# EAGLE design FEZ Panda (EAGLE 5.04)
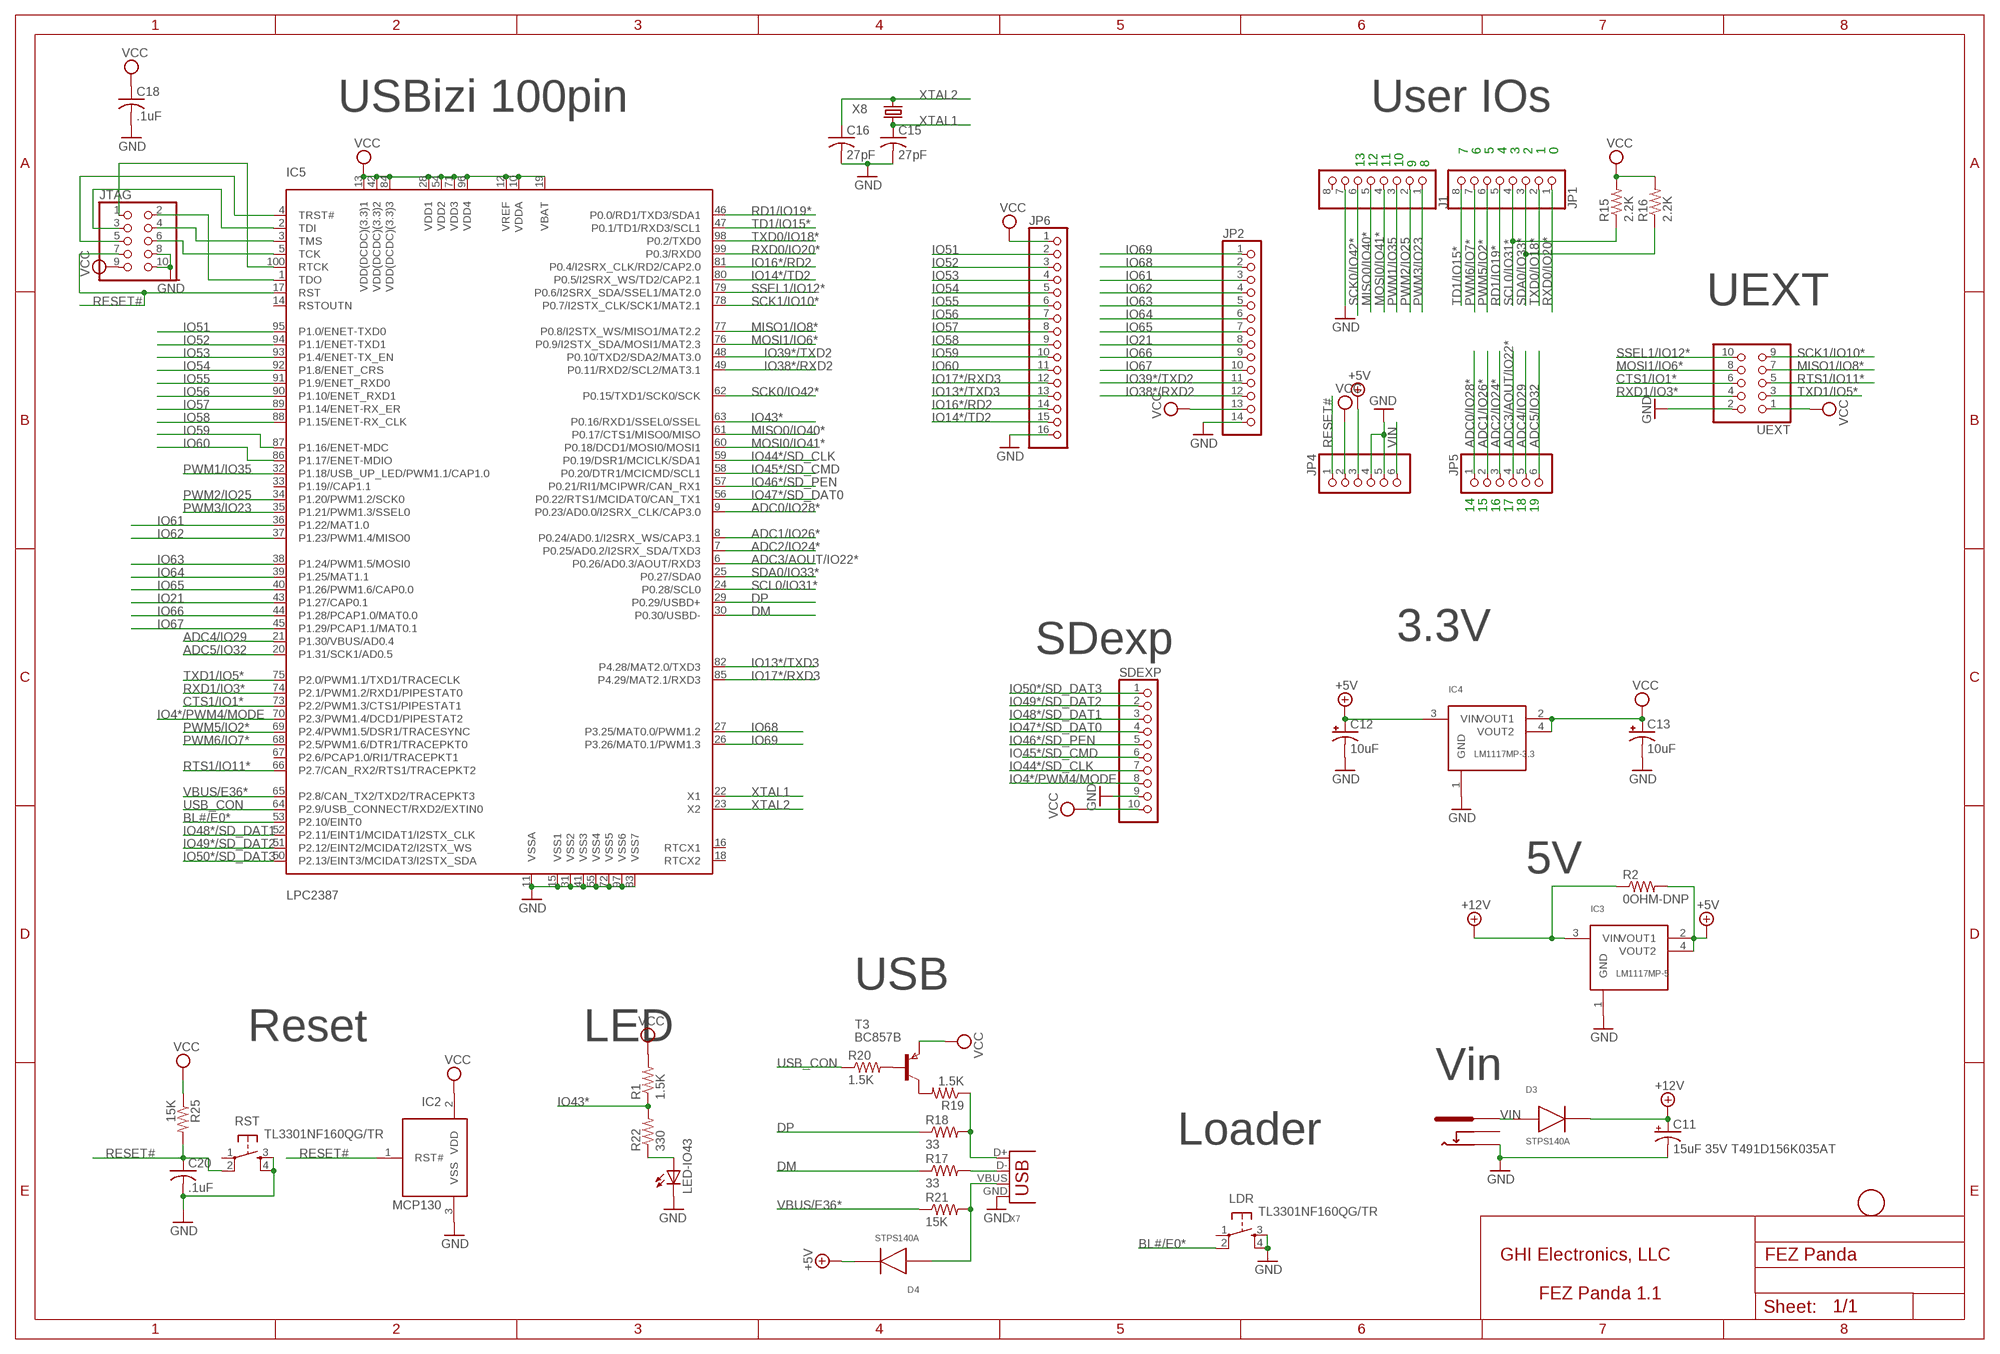
[diagram p0: schematic, sheet 1]

## Parts
C11  15uF 35V T491D156K035AT  CPOL-USD/7343-31W  [D/7343-31W]
C12  10uF  CPOL-USCT3528  [CT3528]
C13  10uF  CPOL-USCT3528  [CT3528]
C15  27pF  C-USC0603K  [C0603K]
C16  27pF  C-USC0603K  [C0603K]
C18  .1uF  C-USC0603K  [C0603K]
C20  .1uF  C-USC0603K  [C0603K]
D3  STPS140A  DIODE_SMA  [DIODE_SMA]
D4  STPS140A  DIODE_SMA  [DIODE_SMA]
IC2  MCP130  [SOT23]
IC3  LM1117MP-5  LM1117  [SOT223]
IC4  LM1117MP-3.3  LM1117  [SOT223]
IC5  LPC2387  LPC2368  [LQFP100]
J1  PINHD-1X8  [1X08]
JP1  PINHD-1X8  [1X08]
JP2  PINHD-1X14  [1X14]
JP4  PINHD-1X6  [1X06]
JP5  PINHD-1X6  [1X06]
JP6  PINHD-1X16  [1X16]
JTAG  PINHD-2X5  [2X05]
LDR  TL3301NF160QG/TR  DTSM-6  [DTSM-6]
LED-IO43  LEDCHIPLED_0805  [CHIPLED_0805]
R1  1.5K  R-US_R0603  [R0603]
R2  0OHM-DNP  R-US_R1206  [R1206]
R15  2.2K  R-US_R0603  [R0603]
R16  2.2K  R-US_R0603  [R0603]
R17  33  R-US_R0603  [R0603]
R18  33  R-US_R0603  [R0603]
R19  1.5K  R-US_R0603  [R0603]
R20  1.5K  R-US_R0603  [R0603]
R21  15K  R-US_R0603  [R0603]
R22  330  R-US_R0603  [R0603]
R25  15K  R-US_R0603  [R0603]
RST  TL3301NF160QG/TR  DTSM-6  [DTSM-6]
SDEXP  PINHD-1X10  [1X10]
T3  BC857B  PNPSOT23  [SOT-23]
U$1  FIDUCIALMOUNT  [FIDUCIA-MOUNT]
UEXT  PINHD-2X5  [2X05]
X6  PJ-102B_POWER_CON  [PJ-102B_POWER_CON]
X7  DX2R005HN2E700  USB-MB-S  [USB-MB-S]
X8  12Mhz  CRYTALSM49  [SM49]

## Nets
+5V: C12.+ D4.K IC3.2(VOUT1) IC3.4(VOUT2) IC4.3(VIN) JP4.3 R2.2
+12V: C11.+ D3.K IC3.3(VIN) R2.1
ADC0/IO28*: IC5.9(P0.23/AD0.0/I2SRX_CLK/CAP3.0) JP5.1
ADC1/IO26*: IC5.8(P0.24/AD0.1/I2SRX_WS/CAP3.1) JP5.2
ADC2/IO24*: IC5.7(P0.25/AD0.2/I2SRX_SDA/TXD3) JP5.3
ADC3/AOUT/IO22*: IC5.6(P0.26/AD0.3/AOUT/RXD3) JP5.4
ADC4/IO29: IC5.21(P1.30/VBUS/AD0.4) JP5.5
ADC5/IO32: IC5.20(P1.31/SCK1/AD0.5) JP5.6
BL#/E0*: IC5.53(P2.10/EINT0) LDR.2
CTS1/IO1*: IC5.73(P2.2/PWM1.3/CTS1/PIPESTAT1) UEXT.6
DM: IC5.30(P0.30/USBD-) R17.1
DP: IC5.29(P0.29/USBD+) R18.1
GND: C11.- C12.- C13.- C15.2 C16.2 C18.2 C20.2 IC2.3(VSS) IC3.1(GND) IC4.1(GND) IC5.11(VSSA) IC5.15(VSS1) IC5.31(VSS2) IC5.41(VSS3) IC5.55(VSS4) IC5.72(VSS5) IC5.83(VSS7) IC5.97(VSS6) J1.7 JP2.14 JP4.4 JP4.5 JP6.16 JTAG.8 JTAG.10 LDR.3 LDR.4 LED-IO43.C RST.3 RST.4 SDEXP.9 UEXT.2 X6.OUT X7.GND
IO4*/PWM4/MODE: IC5.70(P2.3/PWM1.4/DCD1/PIPESTAT2) SDEXP.8
IO13*/TXD3: IC5.82(P4.28/MAT2.0/TXD3) JP6.13
IO14*/TD2: IC5.80(P0.5/I2SRX_WS/TD2/CAP2.1) JP6.15
IO16*/RD2: IC5.81(P0.4/I2SRX_CLK/RD2/CAP2.0) JP6.14
IO17*/RXD3: IC5.85(P4.29/MAT2.1/RXD3) JP6.12
IO21: IC5.43(P1.27/CAP0.1) JP2.8
IO38*/RXD2: IC5.49(P0.11/RXD2/SCL2/MAT3.1) JP2.12
IO39*/TXD2: IC5.48(P0.10/TXD2/SDA2/MAT3.0) JP2.11
IO43*: IC5.63(P0.16/RXD1/SSEL0/SSEL) R1.1 R22.2
IO44*/SD_CLK: IC5.59(P0.19/DSR1/MCICLK/SDA1) SDEXP.7
IO45*/SD_CMD: IC5.58(P0.20/DTR1/MCICMD/SCL1) SDEXP.6
IO46*/SD_PEN: IC5.57(P0.21/RI1/MCIPWR/CAN_RX1) SDEXP.5
IO47*/SD_DAT0: IC5.56(P0.22/RTS1/MCIDAT0/CAN_TX1) SDEXP.4
IO48*/SD_DAT1: IC5.52(P2.11/EINT1/MCIDAT1/I2STX_CLK) SDEXP.3
IO49*/SD_DAT2: IC5.51(P2.12/EINT2/MCIDAT2/I2STX_WS) SDEXP.2
IO50*/SD_DAT3: IC5.50(P2.13/EINT3/MCIDAT3/I2STX_SDA) SDEXP.1
IO51: IC5.95(P1.0/ENET-TXD0) JP6.2
IO52: IC5.94(P1.1/ENET-TXD1) JP6.3
IO53: IC5.93(P1.4/ENET-TX_EN) JP6.4
IO54: IC5.92(P1.8/ENET_CRS) JP6.5
IO55: IC5.91(P1.9/ENET_RXD0) JP6.6
IO56: IC5.90(P1.10/ENET_RXD1) JP6.7
IO57: IC5.89(P1.14/ENET-RX_ER) JP6.8
IO58: IC5.88(P1.15/ENET-RX_CLK) JP6.9
IO59: IC5.87(P1.16/ENET-MDC) JP6.10
IO60: IC5.86(P1.17/ENET-MDIO) JP6.11
IO61: IC5.36(P1.22/MAT1.0) JP2.3
IO62: IC5.37(P1.23/PWM1.4/MISO0) JP2.4
IO63: IC5.38(P1.24/PWM1.5/MOSI0) JP2.5
IO64: IC5.39(P1.25/MAT1.1) JP2.6
IO65: IC5.40(P1.26/PWM1.6/CAP0.0) JP2.7
IO66: IC5.44(P1.28/PCAP1.0/MAT0.0) JP2.9
IO67: IC5.45(P1.29/PCAP1.1/MAT0.1) JP2.10
IO68: IC5.27(P3.25/MAT0.0/PWM1.2) JP2.2
IO69: IC5.26(P3.26/MAT0.1/PWM1.3) JP2.1
MISO0/IO40*: IC5.61(P0.17/CTS1/MISO0/MISO) J1.5
MISO1/IO8*: IC5.77(P0.8/I2STX_WS/MISO1/MAT2.2) UEXT.7
MOSI0/IO41*: IC5.60(P0.18/DCD1/MOSI0/MOSI1) J1.4
MOSI1/IO6*: IC5.76(P0.9/I2STX_SDA/MOSI1/MAT2.3) UEXT.8
N$1: IC5.2(TDI) JTAG.3
N$2: IC5.3(TMS) JTAG.4
N$3: IC5.5(TCK) JTAG.6
N$4: IC5.100(RTCK) JTAG.1
N$5: IC5.1(TDO) JTAG.2
N$6: R18.2 R19.1 X7.D+
N$7: R17.2 X7.D-
N$8: R20.2 T3.3(B)
N$9: IC5.4(TRST#) JTAG.5
N$10: R19.2 T3.1(C)
N$11: D4.A R21.2 X7.VBUS
N$12: LED-IO43.A R22.1
PWM1/IO35: IC5.32(P1.18/USB_UP_LED/PWM1.1/CAP1.0) J1.3
PWM2/IO25: IC5.34(P1.20/PWM1.2/SCK0) J1.2
PWM3/IO23: IC5.35(P1.21/PWM1.3/SSEL0) J1.1
PWM5/IO2*: IC5.69(P2.4/PWM1.5/DSR1/TRACESYNC) JP1.6
PWM6/IO7*: IC5.68(P2.5/PWM1.6/DTR1/TRACEPKT0) JP1.7
RD1/IO19*: IC5.46(P0.0/RD1/TXD3/SDA1) JP1.5
RESET#: C20.1 IC2.1(RST#) IC5.17(RST) JP4.1 JTAG.7 R25.2 RST.2
RTS1/IO11*: IC5.66(P2.7/CAN_RX2/RTS1/TRACEPKT2) UEXT.5
RXD0/IO20*: IC5.99(P0.3/RXD0) JP1.1
RXD1/IO3*: IC5.74(P2.1/PWM1.2/RXD1/PIPESTAT0) UEXT.4
SCK0/IO42*: IC5.62(P0.15/TXD1/SCK0/SCK) J1.6
SCK1/IO10*: IC5.78(P0.7/I2STX_CLK/SCK1/MAT2.1) UEXT.9
SCL0/IO31*: IC5.24(P0.28/SCL0) JP1.4 R15.1
SDA0/IO33*: IC5.25(P0.27/SDA0) JP1.3 R16.1
SSEL1/IO12*: IC5.79(P0.6/I2SRX_SDA/SSEL1/MAT2.0) UEXT.10
TD1/IO15*: IC5.47(P0.1/TD1/RXD3/SCL1) JP1.8
TXD0/IO18*: IC5.98(P0.2/TXD0) JP1.2
TXD1/IO5*: IC5.75(P2.0/PWM1.1/TXD1/TRACECLK) UEXT.3
USB_CON: IC5.64(P2.9/USB_CONNECT/RXD2/EXTIN0) R20.1
VBUS/E36*: IC5.65(P2.8/CAN_TX2/TXD2/TRACEPKT3) R21.1
VCC: C13.+ C18.1 IC2.2(VDD) IC4.2(VOUT1) IC4.4(VOUT2) IC5.10(VDDA) IC5.12(VREF) IC5.13(VDD(DCDC)(3.3)1) IC5.19(VBAT) IC5.28(VDD1) IC5.42(VDD(DCDC)(3.3)2) IC5.54(VDD2) IC5.71(VDD3) IC5.84(VDD(DCDC)(3.3)3) IC5.96(VDD4) JP2.13 JP4.2 JP6.1 JTAG.9 R1.2 R15.2 R16.2 R25.1 SDEXP.10 T3.2(E) UEXT.1
VIN: D3.A JP4.6 X6.IN
XTAL1: C15.1 IC5.22(X1) X8.1
XTAL2: C16.1 IC5.23(X2) X8.2
Unconnected: IC5.14(RSTOUTN) IC5.16(RTCX1) IC5.18(RTCX2) IC5.33(P1.19//CAP1.1) IC5.67(P2.6/PCAP1.0/RI1/TRACEPKT1) J1.8 LDR.1 RST.1 X6.OUT_CON

## Notes on the sheet
- USBizi 100pin | User IOs
- 7 | 6 | 5 | 4 | 3 | 2 | 1 | 0
- 13 | 12 | 11 | 10 | 9 | 8
- UEXT
- 14 | 15 | 16 | 17 | 18 | 19
- SDexp | 3.3V
- 5V
- USB
- Reset | LED
- Vin
- Loader
- GHI Electronics, LLC
- FEZ Panda 1.1

## Library data of the parts
C11-C13 = rcl:CPOL-US: POLARIZED CAPACITOR, American symbol
C15 C16 C18 C20 = rcl:C-US: CAPACITOR, American symbol
D3 D4 = GHI:DIODE_SMA
IC2 = GHI:MCP130
IC3 IC4 = GHI:LM1117
IC5 = GHI:LPC2368
J1 JP1 = pinhead:PINHD-1X8: PIN HEADER
JP2 = pinhead:PINHD-1X14: PIN HEADER
JP4 JP5 = pinhead:PINHD-1X6: PIN HEADER
JP6 = pinhead:PINHD-1X16: PIN HEADER
JTAG UEXT = pinhead:PINHD-2X5: PIN HEADER
LDR RST = switch-tact:DTSM-6
LED-IO43 = led:LED: LED OSRAM: - CHIPLED LG R971, LG N971, LY N971, LG Q971, LY Q971, LO R971, LY R971 LH N974, LH R974 LS Q976, LO Q976, LY Q976 LO Q996 - Hyper CHIPLED LW Q18S LB Q993, LB Q99A, LB R99A - SideLED LS A670, LO A670, LY A670, LG A670, LP A670 LB A673, LV A673, LT A673, LW A673 LH A674 LY A675 LS A676, LA A676, LO A676, LY A676, LW A676 LS A679, LY A679, LG A679 - Hyper Micro SIDELED® LS Y876, LA Y876, LO Y876, LY Y876 LT Y87S - SmartLED LW L88C, LW L88S LB L89C, LB L89S, LG L890 LS L89K, LO L89K, LY L89K LS L896, LA L896, LO L896, LY L896 - TOPLED LS T670, LO T670, LY T670, LG T670, LP T670 LSG T670, LSP T670, LSY T670, LOP T670, LYG T670 LG T671, LOG T671, LSG T671 LB T673, LV T673, LT T673, LW T673 LH T674 LS T676, LA T676, LO T676, LY T676, LB T676, LH T676, LSB T676, LW T676 LB T67C, LV T67C, LT T67C, LS T67K, LO T67K, LY T67K, LW E67C LS E67B, LA E67B, LO E67B, LY E67B, LB E67C, LV E67C, LT E67C LW T67C LS T679, LY T679, LG T679 LS T770, LO T770, LY T770, LG T770, LP T770 LB T773, LV T773, LT T773, LW T773 LH T774 LS E675, LA E675, LY E675, LS T675 LS T776, LA T776, LO T776, LY T776, LB T776 LHGB T686 LT T68C, LB T68C - Hyper Mini TOPLED® LB M676 - Mini TOPLED Santana® LG M470 LS M47K, LO M47K, LY M47K Source: http://www.osram.convergy.de LUXEON: - LUMILED® LXK2-PW12-R00, LXK2-PW12-S00, LXK2-PW14-U00, LXK2-PW14-V00 LXK2-PM12-R00, LXK2-PM12-S00, LXK2-PM14-U00 LXK2-PE12-Q00, LXK2-PE12-R00, LXK2-PE12-S00, LXK2-PE14-T00, LXK2-PE14-U00 LXK2-PB12-K00, LXK2-PB12-L00, LXK2-PB12-M00, LXK2-PB14-N00, LXK2-PB14-P00, LXK2-PB14-Q00 LXK2-PR12-L00, LXK2-PR12-M00, LXK2-PR14-Q00, LXK2-PR14-R00 LXK2-PD12-Q00, LXK2-PD12-R00, LXK2-PD12-S00 LXK2-PH12-R00, LXK2-PH12-S00 LXK2-PL12-P00, LXK2-PL12-Q00, LXK2-PL12-R00 Source: www.luxeon.com KINGBRIGHT: KA-3528ASYC Source: www.kingbright.com
R1 R2 R15-R22 R25 = rcl:R-US_: RESISTOR, American symbol
SDEXP = pinhead:PINHD-1X10: PIN HEADER
T3 = zetex:PNPSOT23: PNP TRANSISTOR
U$1 = SmartPrj:FIDUCIALMOUNT
X6 = GHI:PJ-102B_POWER_CON
X7 = con-usb-3:USB: USB Connectors
X8 = crystal:CRYTAL: CRYSTAL

## Net classes
0 default: width 0.254 mm, drill 0.381 mm, clearance 0.203 mm
2 gnd: width 0.254 mm, drill 0.381 mm, clearance 0.203 mm
3 usbvcc: width 0.508 mm, drill 0.508 mm, clearance 2.235 mm

## Board
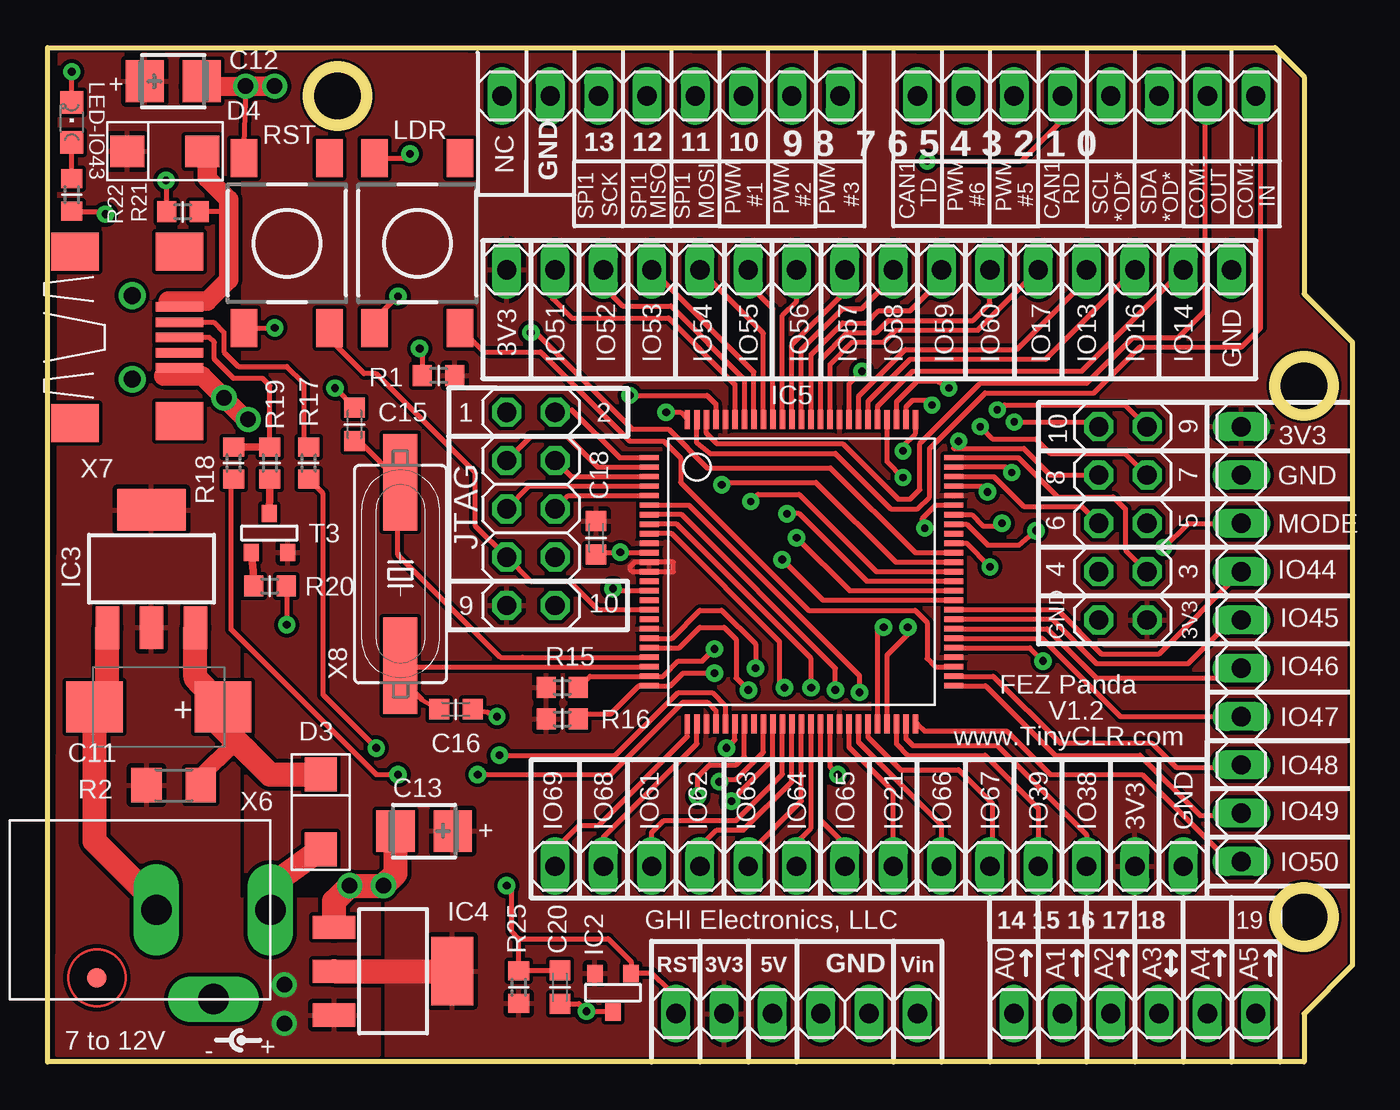
[diagram p1: board, top side]
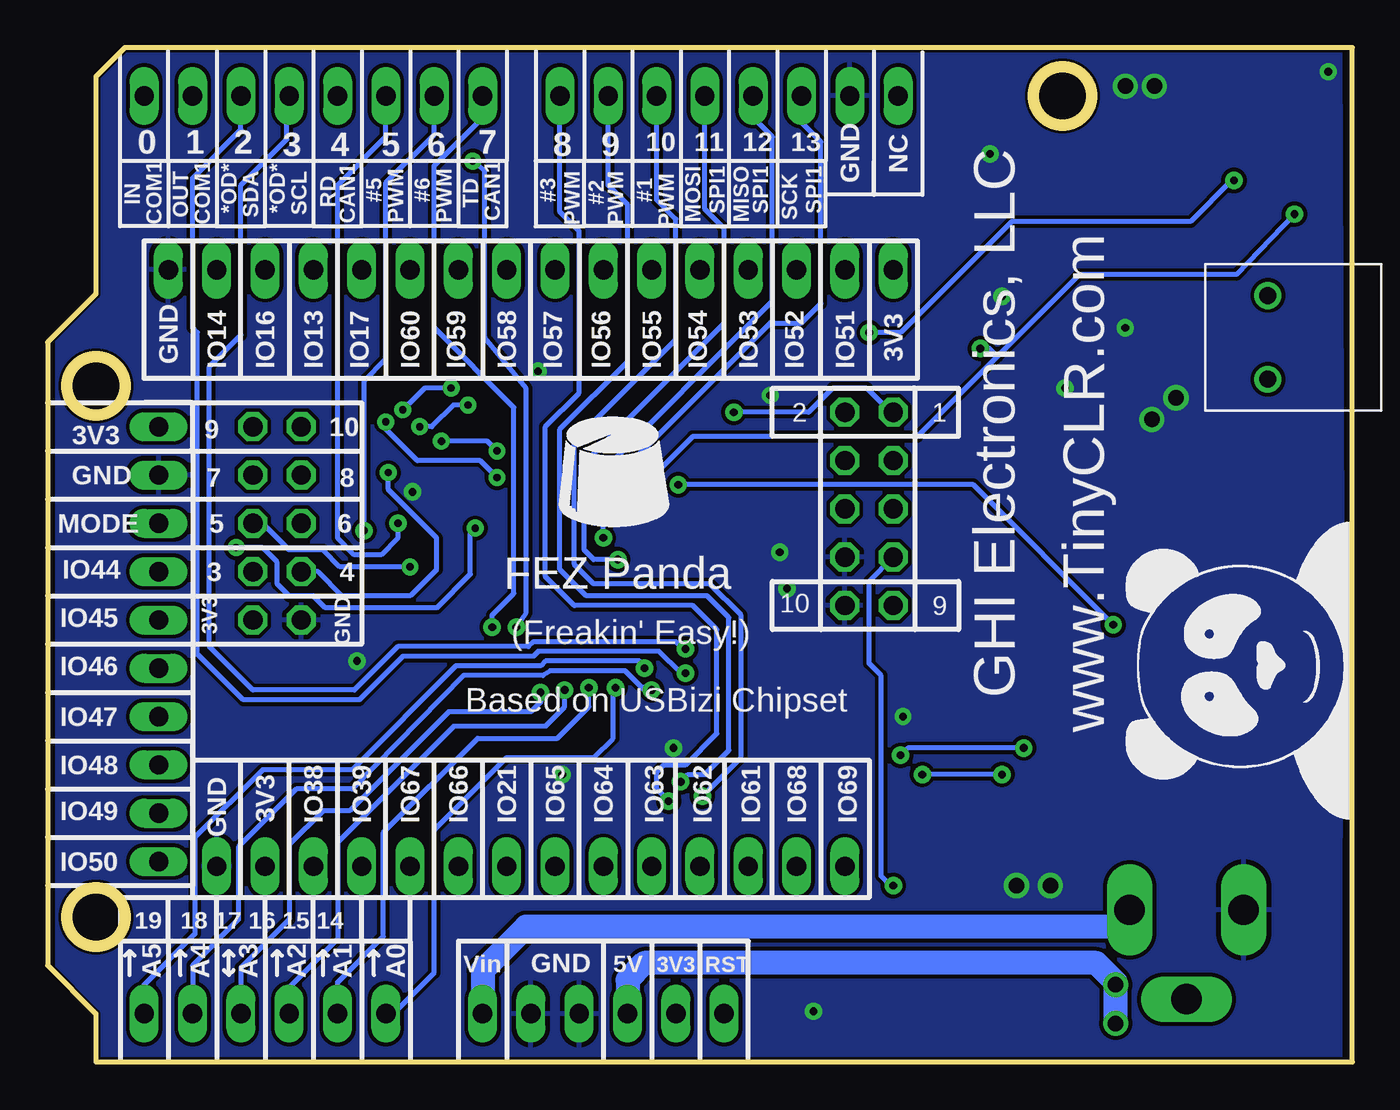
[diagram p2: board, bottom side, seen from below]

Size 68.58 x 53.34 mm. Coordinates in mm from the lower left corner, seen from the top.
Outline: 0,53.34 64.52,53.34 66.04,51.82 66.04,40.39 68.58,37.85 68.58,5.08 66.04,2.54 66.04,0 0,0 0,53.34
Outline: circle at 15.24,50.8 radius 1.52
Outline: circle at 66.04,7.62 radius 1.52
Outline: circle at 66.04,35.56 radius 1.52
Copper layers (1+16): Top 0.035mm / dielectric 1.5mm / Bottom 0.035mm
Design rules "default *": minimum track width 6mil, minimum drill 12mil, track to track 6mil, track to pad 6mil, pad to pad 6mil, via to via 6mil, smd to smd 6mil, copper to edge 5mil, drill to drill 6mil, minimum pad ring 10mil, minimum via ring 10mil, stop-mask expansion 16mil, vias tented up to drill 25mil, thermal gap 10mil
Holes 3.2 mm at 66.04,35.56 66.04,7.62 15.24,50.8

### Footprints (pad centres in the part's own frame; a part is rotated, then mirrored left to right if it is on the bottom)
D/7343-31W = smd 2.95 x 2.7: + 3.375,0; - -3.375,0
CT3528 = smd 2 x 2.2: + 1.5,0; - -1.5,0
C0603K = smd 1.05 x 1.08: 1 -0.875,0; 2 0.875,0
DIODE_SMA = smd 1.778 x 1.676: A -1.905,0; K 2.032,0
SOT23 = smd 0.813 x 0.914: 1 -0.95,-0.973; 2 0.95,-0.973; 3 0,1.049
SOT223 = smd 1.219 x 2.235: 1 -2.311,-3.099; 2 0,-3.099; 3 2.311,-3.099 | smd 3.6 x 2.2: 4 0,3.099
LQFP100 = smd 0.28 x 1: 1 -6,-8; 2 -5.5,-8; 3 -5,-8; 4 -4.5,-8; 5 -4,-8; 6 -3.5,-8; 7 -3,-8; 8 -2.5,-8; 9 -2,-8; 10 -1.5,-8; 11 -1,-8; 12 -0.5,-8; 13 0,-8; 14 0.5,-8; 15 1,-8; 16 1.5,-8; 17 2,-8; 18 2.5,-8; 19 3,-8; 20 3.5,-8; 21 4,-8; 22 4.5,-8; 23 5,-8; 24 5.5,-8; 25 6,-8; 51 6,8; 52 5.5,8; 53 5,8; 54 4.5,8; 55 4,8; 56 3.5,8; 57 3,8; 58 2.5,8; 59 2,8; 60 1.5,8; 61 1,8; 62 0.5,8; 63 0,8; 64 -0.5,8; 65 -1,8; 66 -1.5,8; 67 -2,8; 68 -2.5,8; 69 -3,8; 70 -3.5,8; 71 -4,8; 72 -4.5,8; 73 -5,8; 74 -5.5,8; 75 -6,8 | smd 1 x 0.28: 26 8,-6; 27 8,-5.5; 28 8,-5; 29 8,-4.5; 30 8,-4; 31 8,-3.5; 32 8,-3; 33 8,-2.5; 34 8,-2; 35 8,-1.5; 36 8,-1; 37 8,-0.5; 38 8,0; 39 8,0.5; 40 8,1; 41 8,1.5; 42 8,2; 43 8,2.5; 44 8,3; 45 8,3.5; 46 8,4; 47 8,4.5; 48 8,5; 49 8,5.5; 50 8,6; 76 -8,6; 77 -8,5.5; 78 -8,5; 79 -8,4.5; 80 -8,4; 81 -8,3.5; 82 -8,3; 83 -8,2.5; 84 -8,2; 85 -8,1.5; 86 -8,1; 87 -8,0.5; 88 -8,0; 89 -8,-0.5; 90 -8,-1; 91 -8,-1.5; 92 -8,-2; 93 -8,-2.5; 94 -8,-3; 95 -8,-3.5; 96 -8,-4; 97 -8,-4.5; 98 -8,-5; 99 -8,-5.5; 100 -8,-6
1X08 = drill 1.016 long: 1 -8.89,0; 2 -6.35,0; 3 -3.81,0; 4 -1.27,0; 5 1.27,0; 6 3.81,0; 7 6.35,0; 8 8.89,0
1X14 = drill 1.016 long: 1 -16.51,0; 2 -13.97,0; 3 -11.43,0; 4 -8.89,0; 5 -6.35,0; 6 -3.81,0; 7 -1.27,0; 8 1.27,0; 9 3.81,0; 10 6.35,0; 11 8.89,0; 12 11.43,0; 13 13.97,0; 14 16.51,0
1X06 = drill 1.016 long: 1 -6.35,0; 2 -3.81,0; 3 -1.27,0; 4 1.27,0; 5 3.81,0; 6 6.35,0
1X16 = drill 1.016 long: 1 -19.05,0; 2 -16.51,0; 3 -13.97,0; 4 -11.43,0; 5 -8.89,0; 6 -6.35,0; 7 -3.81,0; 8 -1.27,0; 9 1.27,0; 10 3.81,0; 11 6.35,0; 12 8.89,0; 13 11.43,0; 14 13.97,0; 15 16.51,0; 16 19.05,0
2X05 = drill 1.016 octagon: 1 -5.08,-1.27; 2 -5.08,1.27; 3 -2.54,-1.27; 4 -2.54,1.27; 5 0,-1.27; 6 0,1.27; 7 2.54,-1.27; 8 2.54,1.27; 9 5.08,-1.27; 10 5.08,1.27
DTSM-6 = smd 2 x 1.4: 1 -4.475,2.25; 2 4.475,2.25; 3 -4.475,-2.25; 4 4.475,-2.25
CHIPLED_0805 = smd 1.2 x 1.2: A 0,-1.05; C 0,1.05
R0603 = smd 1 x 1.1: 1 -0.85,0; 2 0.85,0
R1206 = smd 1.6 x 1.803: 1 -1.422,0; 2 1.422,0
1X10 = drill 1.016 long: 1 -11.43,0; 2 -8.89,0; 3 -6.35,0; 4 -3.81,0; 5 -1.27,0; 6 1.27,0; 7 3.81,0; 8 6.35,0; 9 8.89,0; 10 11.43,0
SOT-23 = smd 0.787 x 0.889: 1 0.025,-1.016; 2 -0.94,1.016; 3 0.991,1.016
FIDUCIA-MOUNT = smd 1.016 x 1.016: P$1 0,0
PJ-102B_POWER_CON = drill 1.6 long: IN -6,0; OUT 0,0; OUT_CON -3,4.7
USB-MB-S = smd 2.5 x 0.5: D+ 2.5,0; D- 2.5,0.8; GND 2.5,-1.6; ID 2.5,-0.8; VBUS 2.5,1.6 | smd 2.5 x 2: P$1 -3,-4.5; P$2 -3,4.5; P$3 2.5,-4.4; P$4 2.5,4.5 | drill 0.9 round: P$5 0,2.2; P$6 0,-2.2
SM49 = smd 5.08 x 1.778: 1 -4.826,0; 2 4.826,0

### Placement (x,y rotation side)
C11  5.84,18.67 0 top
C12  6.6,51.56 180 top
C13  19.79,12.14 0 top
C15  16.13,33.53 90 top
C16  21.46,18.54 0 top
C18  28.83,27.56 270 top
C20  26.92,3.94 270 top
D3  14.35,13.08 90 top
D4  6.22,47.88 180 top
IC2  29.72,3.68 180 top
IC3  5.46,25.93 0 top
IC4  18.16,4.78 270 top
IC5  39.62,25.78 270 top
J1  32.77,50.8 180 top
JP1  54.61,50.8 180 top
JP2  43.18,10.29 0 top
JP4  39.37,2.54 0 top
JP5  57.15,2.54 0 top
JP6  43.18,41.66 0 top
JTAG  25.4,29.08 270 top
LDR  19.43,43.05 270 top
LED-IO43  1.27,49.4 0 top
R1  20.55,36.09 0 top
R2  6.63,14.55 180 top
R15  27.05,19.68 180 top
R16  27.05,18.03 180 top
R17  13.72,31.5 90 top
R18  9.78,31.5 90 top
R19  11.68,31.5 270 top
R20  11.68,25.02 180 top
R21  7.11,44.7 0 top
R22  1.27,45.59 270 top
R25  24.77,3.94 90 top
RST  12.57,43.05 270 top
SDEXP  62.74,21.97 90 top
T3  11.68,27.81 180 top
U$1  2.59,4.43 0 top
UEXT  56.52,28.32 90 top
X6  5.71,8 180 top
X7  4.45,38.1 0 top
X8  18.54,25.65 270 top

### Tracks (layer width: path | path; a pad name or v marks a point on that pad's centre or on a via)
+5V  (via drill 0.81)
  Bottom 1.27: JP4.3 38.1,4.32 37.21,5.21 13.46,5.21 12.45,4.19 v12.45,4.06 v12.45,2.03
  pour Top: 10.03,52.96 0.64,52.96 0.51,0.38 17.4,0.38 17.4,8.51 10.03,8.51
+12V
  Top 0.813: R2.1 7.92,14.88 9.91,16.87
  Top 1.27: IC3.3 7.77,20.21 C11.+ 9.12,17.65 9.88,16.89 9.91,16.87 10.54,16.26 11.68,15.11 D3.K
ADC0/IO28*  (via drill 0.41)
  Top 0.254: IC5.9 32.8,27.78 38.48,22.1 38.48,19.94 v38.73,19.68
  Bottom 0.254: JP5.1 50.42,2.54 48.26,4.7 48.26,12.19 44.45,16 39.88,16 38.86,17.02 38.86,19.68 v38.73,19.68
ADC1/IO26*  (via drill 0.41)
  Top 0.254: IC5.8 33.06,28.28 40.13,21.21 40.13,21.08 v40.13,19.68
  Bottom 0.254: 40.39,19.68 v40.13,19.68 40.13,18.67 41.78,17.02 45.97,17.02 50.93,12.06 50.93,6.6 53.34,4.19 JP5.2
ADC2/IO24*  (via drill 0.41)
  Top 0.254: IC5.7 33.32,28.78 41.4,20.7 v41.4,19.56
  Bottom 0.254: 41.4,19.68 v41.4,19.56 41.4,18.67 42.42,17.65 47.24,17.65 53.34,11.56 53.34,6.48 55.88,3.94 JP5.3
ADC3/AOUT/IO22*  (via drill 0.41)
  Top 0.254: IC5.6 33.71,29.28 42.67,20.32 v42.67,19.43
  Bottom 0.254: JP5.4 58.42,4.95 55.88,7.49 55.88,11.43 54.1,13.21 52.7,13.21 47.5,18.41 43.18,18.41 42.67,18.92 v42.67,19.43
ADC4/IO29  (via drill 0.41)
  Top 0.254: IC5.21 33.21,21.78 34.29,22.86 35.56,22.86 36.2,22.23 36.2,20.19 v36.83,19.56
  Bottom 0.254: JP5.5 60.96,5.08 58.55,7.49 58.55,11.3 55.5,14.35 52.58,14.35 46.74,20.32 42.55,20.32 42.16,20.57 38.23,20.57 37.21,19.56 37.34,19.68 36.96,19.68 v36.83,19.56
ADC5/IO32  (via drill 0.41)
  Top 0.254: IC5.20 32.82,22.28 34.29,23.75 35.43,23.75 37.21,21.97 v37.21,20.7 37.21,20.83
  Bottom 0.254: JP5.6 63.5,4.06 60.83,6.73 60.83,11.81 57.28,15.37 52.58,15.37 47.12,20.83 42.67,20.83 42.42,21.08 37.47,21.08 37.21,20.83 v37.21,20.7
BL#/E0*
  Top 0.254: IC5.53 46.66,20.78 46.23,21.21 46.23,23.11 45.59,23.75 40.01,23.75 33.27,30.48 33.27,31.75 32.38,32.64 30.61,32.64 25.91,37.34 22.92,37.34 LDR.2
CTS1/IO1*
  Top 0.254: IC5.73 49.74,30.78 51.31,29.21 54.36,29.21 UEXT.6
DM  (via drill 0.41)
  Top 0.254: IC5.30 35.62,18.73 34.92,19.43 33.15,19.43 29.84,16.13 v23.75,16.13 | v17.27,16.51 14.48,19.3 14.48,29.88 R17.1
  Bottom 0.254: v17.27,16.51 23.37,16.51 v23.75,16.13
DP  (via drill 0.41)
  Top 0.254: IC5.29 35.12,18.47 34.67,18.92 33.4,18.92 29.59,15.11 v22.61,15.11 | R18.1 9.65,30.52 9.65,22.73 17.27,15.11 v18.41,15.11
  Bottom 0.254: v18.41,15.11 v22.61,15.11
GND  (via drill 0.38, 0.41, 0.81)
  Top 0.254: IC5.72 49.09,30.28 v49.4,29.97 | IC5.83 42.12,35.65 v42.8,36.32 | 29.86,26.78 IC5.11 | 29.86,26.78 v30.1,26.8 | IC5.15 29.83,24.78 v29.72,24.89 | IC5.31 36.12,16.95 v35.69,16.51 | v41.53,15.11 41.12,15.52 IC5.41 | IC5.55 51.62,21.78 v52.32,21.08 | C20.2 27.93,3.06 v28.32,2.67 29.68,2.67 IC2.3 | IC5.97 35.12,34.6 34.67,35.05 v30.61,35.05 | C16.2 23.1,18.4 v23.62,18.16 | LED-IO43.C v1.27,52.07 | C15.2 16.13,34.42 v15.11,35.43 | RST.4 11.91,38.58 v11.94,38.61 | RST.3 10.45,51.27 v10.41,51.31 | LDR.3 18.83,47.53 v19.05,47.75 | LDR.4 17.18,39.02 v18.41,40.26 | 29.86,26.78 28.93,26.78 C18.2
  Top 0.305: X7.GND 6.53,36.5 6.1,36.07
  Top 1.016: C12.- 8.31,51.31 8.08,51.28 7.59,51.28 v10.41,51.31 v11.94,51.31 | 6.1,36.07 8.13,36.07 v9.27,34.92 10.41,33.78 v10.54,33.78
  Top 1.27: IC3.1 3.15,19.43 C11.- 2.47,11.61 5.46,8.64 5.46,8.26 X6.OUT | IC4.1 15.06,8.46 v15.88,9.27 v17.65,9.27 18.29,9.9 C13.-
  pour Bottom: 0.64,53.59 68.07,53.59 68.07,0 0.64,0 0.64,10.67 0.51,21.46
IO4*/PWM4/MODE  (via drill 0.38)
  Top 0.254: SDEXP.8 59.94,28.32 v58.67,27.05 | IC5.70 46.68,29.28 45.97,28.57 45.97,28.19 v46.1,28.07
  Bottom 0.254: v58.67,27.05 57.28,27.05 56.52,26.29 56.52,25.15 55.88,24.51 54.61,24.51 53.98,23.88 48.13,23.88 46.35,25.65 46.35,27.81 v46.1,28.07
IO13*/TXD3
  Top 0.254: IC5.82 42.62,35 45.09,37.47 50.93,37.47 54.61,41.15 JP6.13
IO14*/TD2
  Top 0.254: IC5.80 43.62,34.48 45.47,36.32 54.36,36.32 JP6.15
IO16*/RD2
  Top 0.254: IC5.81 43.12,34.74 45.34,36.96 52.45,36.96 JP6.14
IO17*/RXD3
  Top 0.254: JP6.12 48.9,38.48 44.58,38.48 43.94,37.85 42.29,37.85 41.12,36.68 IC5.85
IO21
  Top 0.254: IC5.43 42.12,16.55 44.45,14.22 JP2.8
IO38*/RXD2
  Top 0.254: IC5.49 45.12,16.98 45.47,16.64 49.91,16.64 54.61,11.94 JP2.12
IO39*/TXD2
  Top 0.254: IC5.48 44.62,16.72 45.21,16.13 49.28,16.13 52.07,13.34 JP2.11
IO43*  (via drill 0.38, 0.41)
  Top 0.254: IC5.63 43.56,25.78 39.5,29.84 37.34,29.84 v36.96,29.46 | v3.05,44.58 3.17,44.7 1.31,44.7 R22.2 | R1.1 19.7,37.38 v19.56,37.52
  Bottom 0.254: v36.96,29.46 36.96,30.61 34.67,32.89 22.86,32.89 18.66,37.1 | 18.66,37.1 14.35,41.4 6.1,41.4 v3.05,44.58 | v19.56,37.52 19.07,37.52 18.66,37.1
IO44*/SD_CLK
  Top 0.254: IC5.59 53.05,23.78 55.37,21.46 58.42,21.46 SDEXP.7
IO45*/SD_CMD
  Top 0.254: IC5.58 52.79,23.28 55.12,20.95 59.94,20.95 62.1,23.11 62.7,23.28 SDEXP.6
IO46*/SD_PEN
  Top 0.254: IC5.57 52.53,22.78 55.12,20.19 61.72,20.19 62.23,20.7 SDEXP.5 63.37,20.7
IO47*/SD_DAT0
  Top 0.254: IC5.56 52.27,22.28 56.39,18.16 SDEXP.4
IO48*/SD_DAT1
  Top 0.254: SDEXP.3 62.61,15.49 59.31,15.49 58.04,16.76 53.21,16.76 49.7,20.28 IC5.52
IO49*/SD_DAT2
  Top 0.254: SDEXP.2 62.61,12.95 60.58,12.95 57.4,16.13 52.96,16.13 49.31,19.78 IC5.51
IO50*/SD_DAT3
  Top 0.254: IC5.50 45.72,17.78 46.1,17.4 50.42,17.4 52.7,15.11 57.53,15.11 62.1,10.54 SDEXP.1
IO51
  Top 0.254: IC5.95 36.12,35.63 32.64,39.12 27.56,39.12 26.54,40.13 26.54,41.53 JP6.2
IO52
  Top 0.254: IC5.94 36.62,35.89 32.77,39.75 30.23,39.75 29.34,40.64 29.34,41.53 JP6.3
IO53
  Top 0.254: IC5.93 37.12,36.28 JP6.4
IO54
  Top 0.254: IC5.92 37.62,38.32 JP6.5
IO55
  Top 0.254: IC5.91 38.12,39.6 36.96,40.77 36.96,41.53 JP6.6
IO56
  Top 0.254: IC5.90 38.62,39.26 39.37,40.01 JP6.7
IO57
  Top 0.254: IC5.89 39.12,37.73 41.78,40.39 JP6.8
IO58
  Top 0.254: IC5.88 39.62,37.47 41.78,39.62 42.8,39.62 44.45,41.27 JP6.9
IO59
  Top 0.254: IC5.87 40.12,37.2 41.78,38.86 43.05,38.86 43.69,39.5 45.34,39.5 46.48,40.64 46.48,41.27 46.61,41.27 JP6.10
IO60
  Top 0.254: IC5.86 40.62,36.94 42.04,38.35 43.56,38.35 44.2,38.99 48.64,38.99 49.53,39.88 JP6.11
IO61
  Top 0.254: IC5.36 38.62,15.13 36.2,12.7 32.38,12.7 31.75,12.06 JP2.3
IO62
  Top 0.254: IC5.37 39.12,14.74 36.58,12.19 35.18,12.19 34.16,11.18 34.16,10.41 JP2.4
IO63
  Top 0.254: IC5.38 39.62,13.72 36.83,10.92 JP2.5
IO64
  Top 0.254: IC5.39 40.12,12.31 39.12,11.3 39.12,10.54 JP2.6
IO65
  Top 0.254: IC5.40 40.62,12.72 41.91,11.43 JP2.7
IO66
  Top 0.254: IC5.44 42.62,16.81 46.99,12.45 JP2.9
IO67
  Top 0.254: IC5.45 43.12,17.07 44.83,15.37 47.88,15.37 49.66,13.59 49.66,10.41 JP2.10
IO68
  Top 0.254: IC5.27 34.12,16.73 29.21,11.81 JP2.2
IO69
  Top 0.254: IC5.26 33.62,17.11 28.96,12.45 27.94,12.45 26.67,11.18 JP2.1
MISO0/IO40*  (via drill 0.41)
  Top 0.254: IC5.61 42.15,24.78 v39.37,27.56
  Bottom 0.254: J1.5 31.5,49.66 30.48,48.64 30.48,40.01 39.88,30.61 39.88,28.7 39.37,28.19 v39.37,27.56
MISO1/IO8*  (via drill 0.38)
  Top 0.254: v49.02,33.4 49.66,32.77 51.94,32.77 52.7,32 56.64,32 UEXT.7 | IC5.77 45.12,34.46 45.47,34.8 46.23,34.8 v46.48,34.54
  Bottom 0.254: v46.48,34.54 47.24,34.54 48.39,33.4 v49.02,33.4
MOSI0/IO41*  (via drill 0.41)
  Top 0.254: IC5.60 40.74,24.28 v38.61,26.42
  Bottom 0.254: J1.4 34.04,44.83 33.02,43.81 33.02,38.86 40.39,31.5 40.39,26.92 39.88,26.42 v38.61,26.42
MOSI1/IO6*  (via drill 0.38)
  Top 0.254: UEXT.8 52.7,30.86 51.31,32.26 47.62,32.26 v47.88,32.64 | v44.96,32.13 44.96,32.38 45.62,33.05 IC5.76
  Bottom 0.254: v44.96,32.13 45.47,32.64 v47.88,32.64
N$1
  Top 0.254: IC5.2 28.92,31.28 27.3,32.89 25.4,32.89 JTAG.3
N$2
  Top 0.254: IC5.3 27.51,30.78 JTAG.4
N$3
  Top 0.254: IC5.5 27.37,29.78 JTAG.6
N$4  (via drill 0.41)
  Top 0.254: IC5.100 33.62,33.81 33.27,34.16 v32.51,34.16
  Bottom 0.254: v32.51,34.16 28.57,34.16 27.3,35.43 25.53,35.43 24.13,34.04 JTAG.1
N$5
  Top 0.254: IC5.1 30.07,31.78 27.56,34.29 26.92,34.29 26.8,34.16 JTAG.2
N$6
  Top 0.254: X7.D+ 8.51,38.1 8.76,37.85 8.76,36.96 9.78,35.94 11.3,35.94 11.68,35.56 R19.1
  Top 0.406: R18.2 R19.1
N$7
  Top 0.254: X7.D- 8.72,38.9 9.27,38.35 9.27,37.34 10.03,36.58 12.57,36.58 13.46,35.69 13.46,32.77 13.72,32.51 R17.2
N$8
  Top 0.406: T3.3 10.82,25.8 R20.2
N$9
  Top 0.254: IC5.4 25.33,30.28 JTAG.5
N$10
  Top 0.406: R19.2 11.68,29.95 T3.1
N$11
  Top 0.254: R21.2 9.27,44.7 9.53,44.96
  Top 0.406: X7.VBUS 6.66,39.7 6.35,40.01
  Top 1.016: 6.35,40.01 8.38,40.01 9.53,41.15 9.53,44.96 9.53,45.34 8.38,46.48 8.38,47.88 8.26,48.01 D4.A
N$12
  Top 0.254: R22.1 LED-IO43.A
PWM1/IO35  (via drill 0.41)
  Top 0.254: IC5.32 36.62,16.05 36.2,15.62 34.8,15.62 34.16,14.99 v34.16,13.97
  Bottom 0.254: J1.3 36.58,45.34 35.56,44.32 35.56,37.97 40.89,32.64 40.89,26.16 39.88,25.15 33.78,25.15 32.13,23.5 32.13,16 v34.16,13.97
PWM2/IO25  (via drill 0.41)
  Top 0.254: IC5.34 37.62,16.29 36.2,14.86 35.43,14.86 v35.31,14.73
  Bottom 0.254: J1.2 39.12,46.1 38.1,45.09 38.1,36.83 41.66,33.27 41.66,25.91 40.26,24.51 33.91,24.51 32.77,23.37 32.77,16.38 34.04,15.11 34.92,15.11 v35.31,14.73
PWM3/IO23  (via drill 0.41)
  Top 0.254: IC5.35 38.12,15.9 v35.94,13.72
  Bottom 0.254: J1.1 41.66,44.7 40.64,43.69 40.64,35.18 42.42,33.4 42.42,25.53 40.89,24 34.67,24 33.4,22.73 33.4,17.27 35.05,15.62 36.2,15.62 36.58,15.24 36.58,14.35 v35.94,13.72
PWM5/IO2*  (via drill 0.41)
  Top 0.254: IC5.69 48.56,28.78 49.15,28.19 50.04,28.19 v50.16,28.32
  Bottom 0.254: JP1.6 50.8,48.64 53.34,46.1 53.34,27.56 52.45,26.67 51.05,26.67 50.16,27.56 v50.16,28.32
PWM6/IO7*  (via drill 0.41)
  Top 0.254: IC5.68 48.3,28.28 49.4,27.18 51.05,27.18 v51.94,27.94 52.03,28.03
  Bottom 0.254: v51.94,27.94 51.94,35.81 50.8,36.96 50.8,46.23 48.26,48.77 JP1.7
RD1/IO19*  (via drill 0.38, 0.41)
  Top 0.254: IC5.46 43.62,22.67 v43.94,22.86 | v46.23,47.37 51.18,47.37 53.34,49.53 53.34,49.78 JP1.5
  Bottom 0.254: v43.94,22.86 43.43,23.62 43.43,35.43 45.59,38.1 45.59,46.86 v46.23,47.37
RESET#  (via drill 0.41)
  Top 0.254: JP4.1 32.66,2.54 32.66,3.79 31.75,4.7 30.71,4.7 IC2.1 30.67,5.27 29.46,6.48 24.77,6.48 | 24.77,6.48 24.38,6.86 24.38,9.02 v24.13,9.27 | C20.1 25.3,4.81 R25.2 24.77,6.48 | RST.2 14.86,38.49 14.86,37.97 16.64,36.2 17.27,36.2 22.48,30.99 22.48,28.19 JTAG.7 25.4,25.27 27.43,25.27 28.92,23.78 IC5.17
  Bottom 0.254: v24.13,9.27 24.26,9.27 24.77,9.78 24.77,20.32 25.4,20.95 25.4,25.27 JTAG.7
RTS1/IO11*  (via drill 0.38)
  Top 0.254: IC5.66 48.28,27.28 v49.53,26.04
  Bottom 0.254: v49.53,26.04 53.21,26.04 54.1,26.92 55.88,26.92 57.15,28.19 57.66,28.19 UEXT.5
RXD0/IO20*
  Top 0.254: IC5.99 34.12,32.55 34.8,32 41.4,32 44.32,29.08 45.72,29.08 46.35,29.72 46.35,32.26 49.15,35.05 49.28,35.18 54.99,35.18 57.4,37.59 62.74,37.59 63.75,38.61 63.75,50.55 JP1.1
RXD1/IO3*  (via drill 0.38)
  Top 0.254: IC5.74 50.38,31.28 v50.67,30.99
  Bottom 0.254: UEXT.4 54.36,25.78 53.09,24.51 49.53,24.51 48.13,25.91 48.13,27.56 50.67,30.1 v50.67,30.99
SCK0/IO42*  (via drill 0.41)
  Top 0.254: IC5.62 43.05,25.28 39.5,28.83 v38.86,28.83
  Bottom 0.254: v38.86,28.83 38.99,30.48 30.61,38.86 28.96,38.86 27.94,39.88 27.94,48.39 29.08,49.53 29.08,50.67 J1.6
SCK1/IO10*  (via drill 0.38)
  Top 0.254: v49.91,34.29 50.04,34.29 50.29,34.54 56.64,34.54 UEXT.9 | IC5.78 44.62,34.72 45.72,35.81 46.74,35.81 v47.37,35.43
  Bottom 0.254: v47.37,35.43 48.77,35.43 v49.91,34.29
SCL0/IO31*  (via drill 0.41)
  Top 0.254: R15.1 28.5,20.28 IC5.24 32.35,20.28 33.15,21.08 34.42,21.08 v35.05,21.72
  Bottom 0.254: v35.05,21.72 35.18,21.72 35.56,22.1 43.05,22.1 43.31,21.84 50.16,21.84 52.45,19.56 57.78,19.56 60.07,21.84 60.07,36.58 58.42,38.23 58.42,46.1 56.01,48.51 56.01,50.67 JP1.4
SDA0/IO33*  (via drill 0.41)
  Top 0.254: R16.1 28.16,18.29 29.59,18.29 31.08,19.78 IC5.25 32.73,19.78 33.4,20.45 v35.05,20.45
  Bottom 0.254: v35.05,20.45 35.31,20.45 36.45,21.59 42.8,21.59 43.05,21.34 49.91,21.34 52.2,19.05 58.29,19.05 60.71,21.46 60.71,38.35 60.96,38.61 60.96,46.48 58.42,49.02 JP1.3
SSEL1/IO12*  (via drill 0.38)
  Top 0.254: IC5.79 44.12,31.57 v44.96,30.73 | v50.8,33.66 54.74,33.66 54.99,33.4 54.99,33.15 UEXT.10
  Bottom 0.254: v50.8,33.66 50.8,33.27 49.15,31.62 45.85,31.62 v44.96,30.73
TD1/IO15*  (via drill 0.41)
  Top 0.254: IC5.47 44.12,21.39 45.21,22.48 v45.21,22.86
  Bottom 0.254: 45.59,50.67 JP1.8 45.72,49.66 48.26,47.12 48.26,38.61 44.07,34.42 44.07,24.64 45.21,23.5 v45.21,22.86
TXD0/IO18*
  Top 0.254: IC5.98 34.62,33.07 35.18,32.51 41.78,32.51 44.7,29.59 45.34,29.59 45.85,30.1 45.85,32.51 49.02,35.69 54.61,35.69 57.02,38.1 59.44,38.1 60.83,39.5 60.83,50.67 JP1.2
TXD1/IO5*
  Top 0.254: IC5.75 51.02,31.78 53.09,29.72 56.01,29.72 56.64,29.08 56.64,26.92 UEXT.3
USB_CON  (via drill 0.41)
  Top 0.254: v12.57,22.99 12.57,24.98 R20.1 | IC5.64 44.59,26.28 40.39,30.48 35.81,30.48 v35.43,30.35
  Bottom 0.254: v35.43,30.35 19.94,30.35 v12.57,22.99
VBUS/E36*  (via drill 0.41)
  Top 0.254: IC5.65 45.61,26.78 41.15,31.24 34.67,31.24 32.64,33.27 30.73,33.27 25.65,38.35 v25.4,38.35 | R21.1 6.26,46.32 v6.22,46.35
  Bottom 0.254: v6.22,46.35 6.35,46.35 8.51,44.2 17.91,44.2 23.75,38.35 v25.4,38.35
VCC
  Top 0.254: IC5.12 30.85,26.28 30.61,26.04 30.61,25.91 30.73,25.78 32.89,25.78 32.89,26.29 IC5.12
  Top 1.27: IC4.2 IC4.4
  pour Top (rank 2): 69.22,-0.13 69.22,52.83 10.29,52.96 10.29,0
VIN
  Top 1.27: X6.IN 11.71,8.67 12.06,9.02 12.06,9.53 D3.A
  Bottom 1.27: JP4.6 45.72,4.83 43.43,7.11 12.6,7.11 X6.IN
XTAL1
  Top 0.254: 23.8,21.28 IC5.22 | 23.8,21.28 18.41,26.67 18.41,29.72 18.54,29.84 X8.1 16.37,32.65 C15.1 | 23.8,21.28 24.96,21.28
XTAL2
  Top 0.254: IC5.23 18.84,20.78 X8.2 18.41,20.95 18.41,20.32 19.68,19.05 C16.1

### Text on the board
tPlace: + | 13 | 12 | 11 | 10 | 9 8 7 6 5 4 3 2 1 0 | NC | GND | PWM | #1 | PWM | #2 | PWM | #3 | TD | PWM | #6 | PWM | #5 | RD | SCL | SDA | OUT | IN | SPI1 | SCK | SPI1 | MISO | SPI1 | MOSI | CAN1 | CAN1 | *OD* | *OD* | COM1 | COM1 | 3V3 | IO51 | IO52 | IO53 | IO54 | IO55 | IO56 | IO57 | IO58 | IO59 | IO60 | IO17 | IO13 | IO16 | IO14 | GND | 1 | 2 | 10 | 9 | 3V3 | 8 | 7 | GND | 6 | 5 | MODE | 4 | 3 | IO44 | 10 | 9 | IO45 | GND | 3V3 | IO46 | FEZ Panda | V1.2 | IO47 | www.TinyCLR.com | IO48 | IO49 | + | IO69 | IO68 | IO61 | IO62 | IO63 | IO64 | IO65 | IO21 | IO66 | IO67 | IO39 | IO38 | 3V3 | GND | IO50 | GHI Electronics, LLC | 14 15 16 17 18 | 19 | RST | 3V3 | 5V | GND | Vin | A0 | A1 | A2 | A3 | A4 | A5 | 7 to 12V | - | +
bPlace: GHI Electronics, LLC | www.TinyCLR.com | 1 | 2 | FEZ Panda | 10 | 9 | (Freakin' Easy!) | Based on USBizi Chipset
bNames: 13 | 12 | 11 | 10 | 9 | 8 | 7 | 6 | 5 | 4 | 3 | 2 | 1 | 0 | NC | SPI1 | SCK | SPI1 | MISO | SPI1 | MOSI | PWM | PWM | PWM | CAN1 | PWM | PWM | CAN1 | RD | SCL | *OD* | SDA | *OD* | COM1 | OUT | COM1 | GND | #1 | #2 | #3 | TD | #6 | #5 | IN | 3V3 | GND | IO51 | IO52 | IO53 | IO54 | IO55 | IO56 | IO57 | IO58 | IO59 | IO60 | IO17 | IO13 | IO16 | IO14 | 10 | 9 | 3V3 | 8 | 7 | GND | 6 | 5 | MODE | 4 | 3 | GND | 3V3 | IO44 | IO45 | IO46 | IO47 | IO69 | IO68 | IO61 | IO62 | IO63 | IO64 | IO65 | IO21 | IO66 | IO67 | IO39 | IO38 | 3V3 | GND | IO48 | IO49 | IO50 | 18 17 16 15 14 | 19 | A0 | A1 | A2 | A3 | A4 | A5 | RST | 3V3 | 5V | GND | Vin
Reference: C8 | R7 | R5 | R6 | R4 | C3 | C2 | R9 | R8 | R1 | R2 | C1 | C4 | C5 | X2 | C7 | C6